# Altium project rp2040.PrjPcb
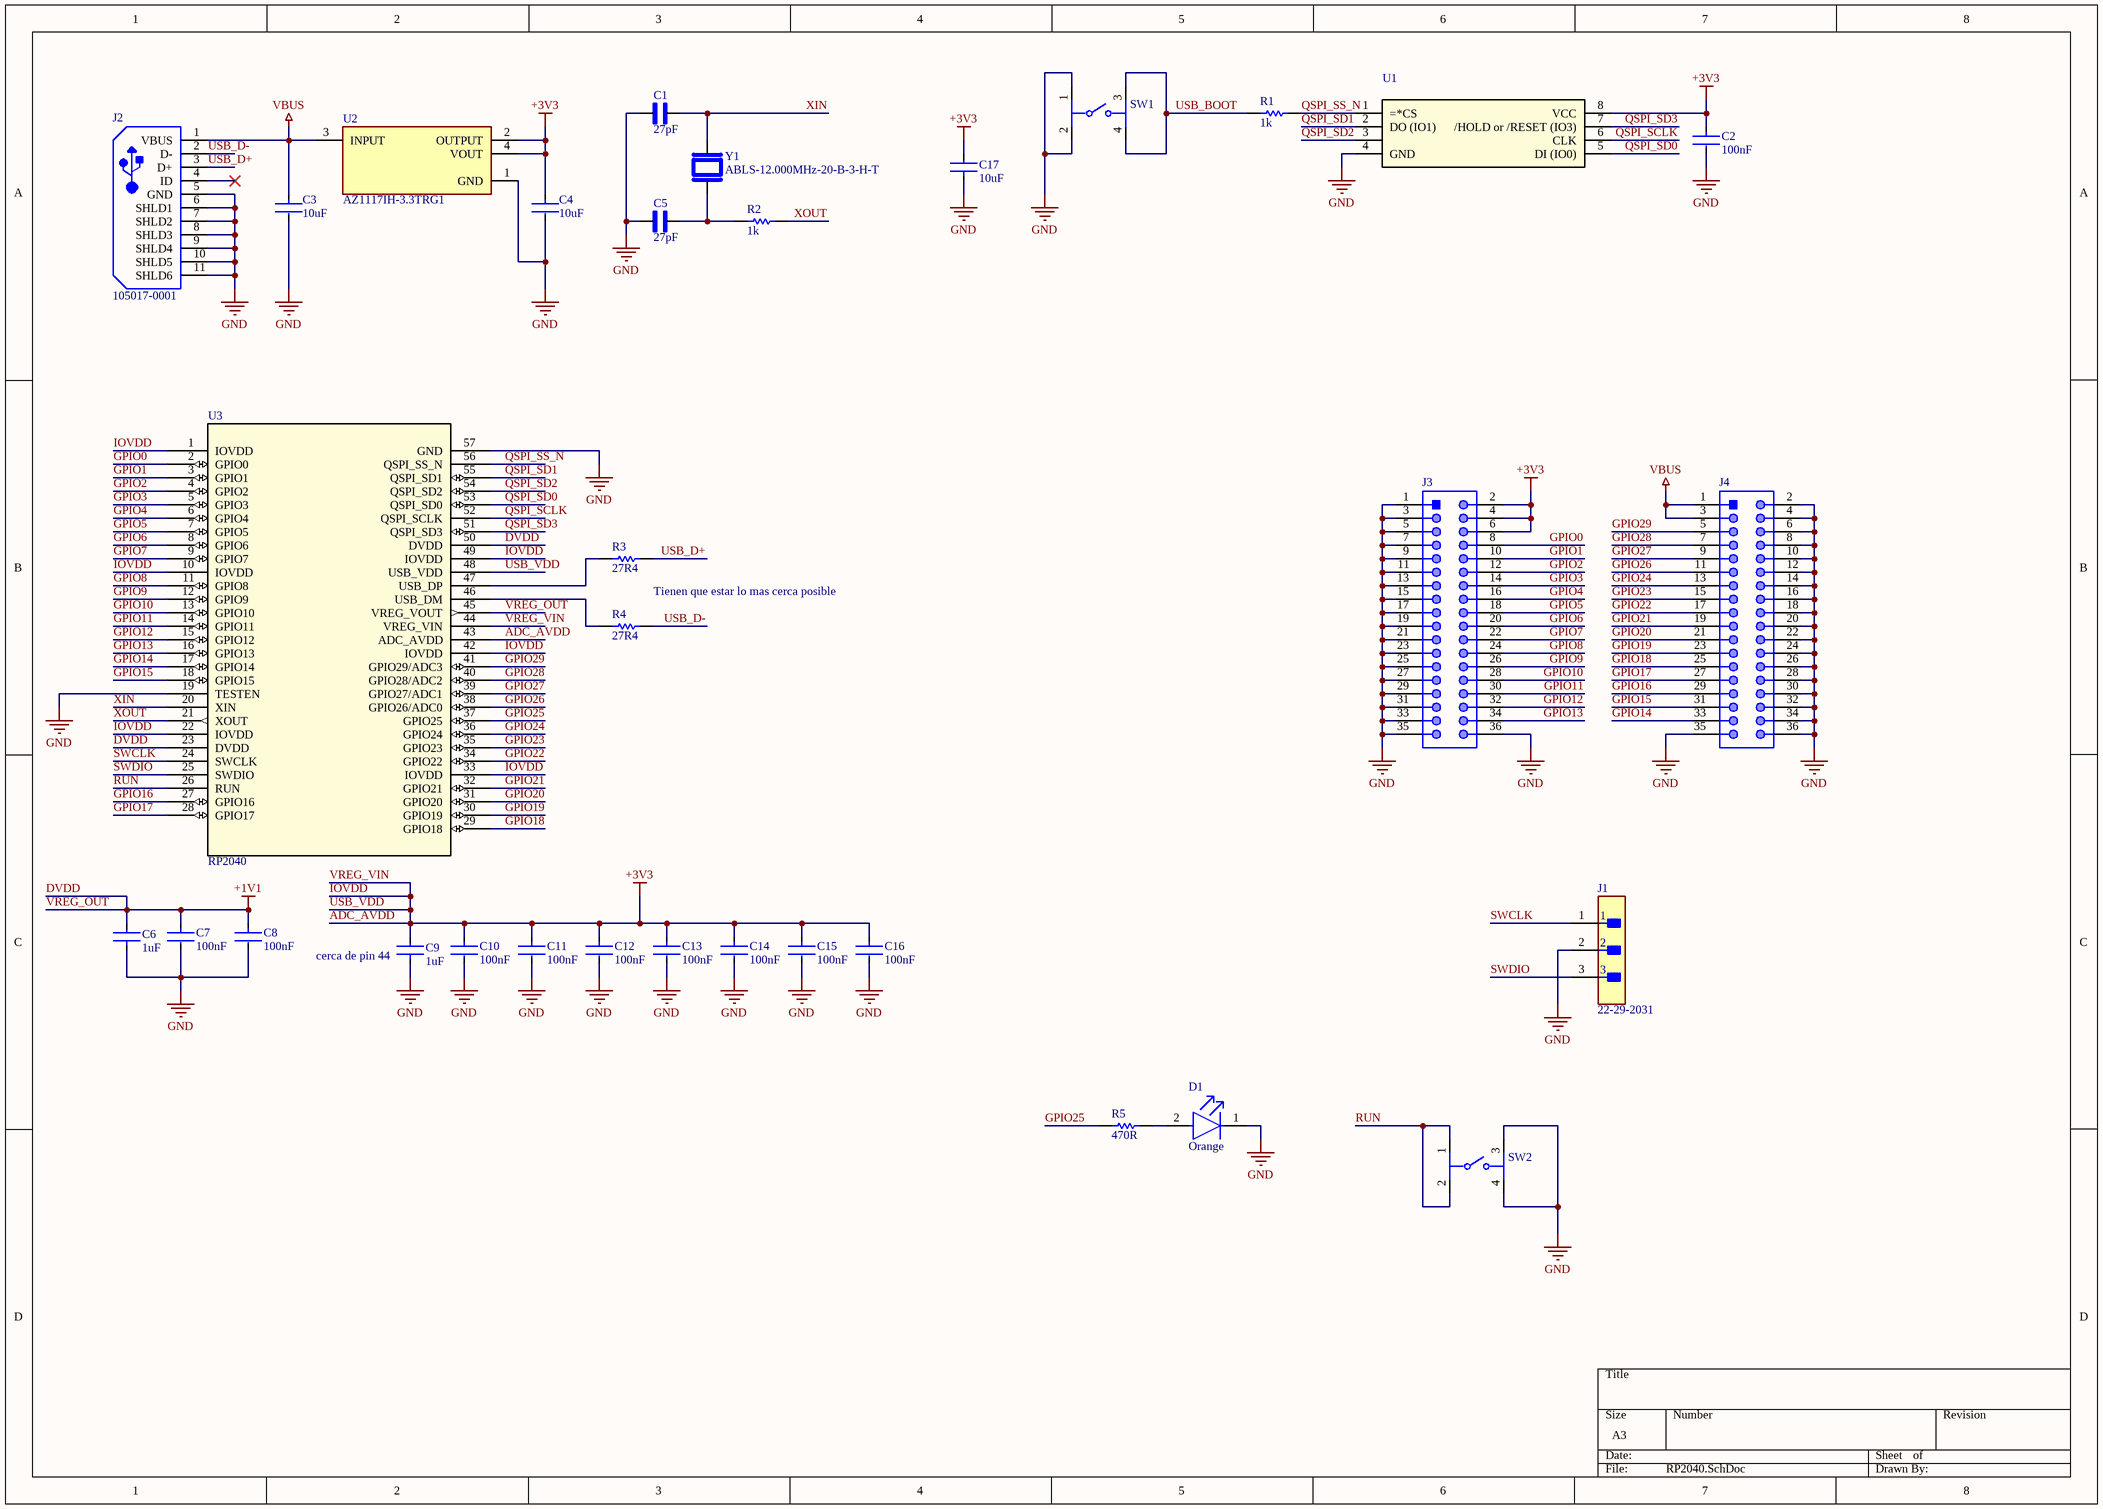
[diagram p0: RP2040.SchDoc]
1 sheet, 33 parts. Net scope: global (net labels, ports and power ports of the same name join across sheets).
Board file: RP2040.PcbDoc

## Sheet RP2040.SchDoc
size A3

### Parts
C1  Capacitance: 27pF  [CAPC2012X140N]  (hidden comment: CL21C270JCANNNC)
C2  Capacitance: 100nF  [FP-CL21-IPC_C]  (hidden comment: CL21B104KBCNNNC)
C3  Capacitance: 10uF  [FP-GRM21B-0_1-IPC_A]  (hidden comment: GRM21BR61C106KE15K)
C4  Capacitance: 10uF  [FP-GRM21B-0_1-IPC_A]  (hidden comment: GRM21BR61C106KE15K)
C5  Capacitance: 27pF  [CAPC2012X140N]  (hidden comment: CL21C270JCANNNC)
C6  Capacitance: 1uF  [FP-CL21-IPC_A]  (hidden comment: CL21B105KOFNNNE)
C7  Capacitance: 100nF  [FP-CL21-IPC_A]  (hidden comment: CL21B104KBCNNNC)
C8  Capacitance: 100nF  [FP-CL21-IPC_A]  (hidden comment: CL21B104KBCNNNC)
C9  Capacitance: 1uF  [FP-CL21-IPC_A]  (hidden comment: CL21B105KOFNNNE)
C10  Capacitance: 100nF  [FP-CL21-IPC_A]  (hidden comment: CL21B104KBCNNNC)
C11  Capacitance: 100nF  [FP-CL21-IPC_A]  (hidden comment: CL21B104KBCNNNC)
C12  Capacitance: 100nF  [FP-CL21-IPC_A]  (hidden comment: CL21B104KBCNNNC)
C13  Capacitance: 100nF  [FP-CL21-IPC_A]  (hidden comment: CL21B104KBCNNNC)
C14  Capacitance: 100nF  [FP-CL21-IPC_A]  (hidden comment: CL21B104KBCNNNC)
C15  Capacitance: 100nF  [FP-CL21-IPC_A]  (hidden comment: CL21B104KBCNNNC)
C16  Capacitance: 100nF  [FP-CL21-IPC_A]  (hidden comment: CL21B104KBCNNNC)
C17  Capacitance: 10uF  [FP-GRM21B-0_1-IPC_A]  (hidden comment: GRM21BR61C106KE15K)
D1  Illumination Color: Orange  [FP-APTR3216SECK-MFG]  (hidden comment: APTR3216SECK)
J1  22-29-2031  [FP-22-29-2031-MFG]
J2  105017-0001  [USB-MICRO-B_V]
J3  61303621121  [61303621121]  (value not drawn)
J4  61303621121  [61303621121]  (value not drawn)
R1  Resistance: 1k  [RESC2013X60X35ML10T20]  (hidden comment: RC0805JR-131KL)
R2  Resistance: 1k  [RESC2013X60X35ML10T20]  (hidden comment: RC0805JR-131KL)
R3  Resistance: 27R4  [RESC2013X60X30NL20T20]  (hidden comment: RK73H2ATTD27R4F)
R4  Resistance: 27R4  [RESC2013X60X30NL20T20]  (hidden comment: RK73H2ATTD27R4F)
R5  Resistance: 470R  [RESC2013X60X35LL10T20]  (hidden comment: RC0805FR-07470RL)
SW1  PTS526SK15SMTR2LFS  [FP-PTS526SK15SMTR2LFS-MFG]  (value not drawn)
SW2  PTS526SK15SMTR2LFS  [FP-PTS526SK15SMTR2LFS-MFG]  (value not drawn)
U1  W25Q128JVSIQ  [W25Q128JVSIQ]  (value not drawn)
U2  AZ1117IH-3.3TRG1  [FP-SOT223-IPC_B]
U3  RP2040  [RP2040]
Y1  ABLS-12.000MHz-20-B-3-H-T  [XTAL_ABLS-12.000MHz-20-B-3-H-T]

### Nets
ADC_AVDD: C2.1 C4.1 C9.2 C10.1 C11.1 C12.1 C13.1 C14.1 C15.1 C16.1 C17.2 J3.2 J3.4 J3.6 U1.8(VCC) U2.2(OUTPUT) U2.4(VOUT) U3.1(IOVDD) U3.10(IOVDD) U3.22(IOVDD) U3.33(IOVDD) U3.42(IOVDD) U3.43(ADC_AVDD) U3.44(VREG_VIN) U3.48(USB_VDD) U3.49(IOVDD)  [also labelled +3V3, IOVDD, USB_VDD, VREG_VIN]
DVDD: C6.2 C7.1 C8.1 U3.23(DVDD) U3.45(VREG_VOUT) U3.50(DVDD)  [also labelled +1V1, VREG_OUT]
GND: C1.2 C2.2 C3.2 C4.2 C5.2 C6.1 C7.2 C8.2 C9.1 C10.2 C11.2 C12.2 C13.2 C14.2 C15.2 C16.2 C17.1 D1.1(C) J1.2 J2.5(GND) J2.6(SHLD1) J2.7(SHLD2) J2.8(SHLD3) J2.9(SHLD4) J2.10(SHLD5) J2.11(SHLD6) J3.1 J3.3 J3.5 J3.7 J3.9 J3.11 J3.13 J3.15 J3.17 J3.19 J3.21 J3.23 J3.25 J3.27 J3.29 J3.31 J3.33 J3.35 J3.36 J4.2 J4.4 J4.6 J4.8 J4.10 J4.12 J4.14 J4.16 J4.18 J4.20 J4.22 J4.24 J4.26 J4.28 J4.30 J4.32 J4.34 J4.35 J4.36 SW1.1 SW1.2 SW2.3 SW2.4 U1.4(GND) U2.1(GND) U3.19(TESTEN) U3.57(GND)
VBUS: C3.1 J2.1(VBUS) J4.1 J4.3 U2.3(INPUT)
GPIO0: J3.8 U3.2(GPIO0)
GPIO1: J3.10 U3.3(GPIO1)
GPIO2: J3.12 U3.4(GPIO2)
GPIO3: J3.14 U3.5(GPIO3)
GPIO4: J3.16 U3.6(GPIO4)
GPIO5: J3.18 U3.7(GPIO5)
GPIO6: J3.20 U3.8(GPIO6)
GPIO7: J3.22 U3.9(GPIO7)
GPIO8: J3.24 U3.11(GPIO8)
GPIO9: J3.26 U3.12(GPIO9)
GPIO10: J3.28 U3.13(GPIO10)
GPIO11: J3.30 U3.14(GPIO11)
GPIO12: J3.32 U3.15(GPIO12)
GPIO13: J3.34 U3.16(GPIO13)
GPIO14: J4.33 U3.17(GPIO14)
GPIO15: J4.31 U3.18(GPIO15)
GPIO16: J4.29 U3.27(GPIO16)
GPIO17: J4.27 U3.28(GPIO17)
GPIO18: J4.25 U3.29(GPIO18)
GPIO19: J4.23 U3.30(GPIO19)
GPIO20: J4.21 U3.31(GPIO20)
GPIO21: J4.19 U3.32(GPIO21)
GPIO22: J4.17 U3.34(GPIO22)
GPIO23: J4.15 U3.35(GPIO23)
GPIO24: J4.13 U3.36(GPIO24)
GPIO25: R5.1 U3.37(GPIO25)
GPIO26: J4.11 U3.38(GPIO26/ADC0)
GPIO27: J4.9 U3.39(GPIO27/ADC1)
GPIO28: J4.7 U3.40(GPIO28/ADC2)
GPIO29: J4.5 U3.41(GPIO29/ADC3)
QSPI_SCLK: U1.6(CLK) U3.52(QSPI_SCLK)
QSPI_SD0: U1.5(DI_(IO0)) U3.53(QSPI_SD0)
QSPI_SD1: U1.2(DO_(IO1)) U3.55(QSPI_SD1)
QSPI_SD2: U1.3(/WP_(IO2)) U3.54(QSPI_SD2)
QSPI_SD3: U1.7(/HOLD_or_/RESET_(IO3)) U3.51(QSPI_SD3)
QSPI_SS_N: R1.1 U1.1(=*CS) U3.56(QSPI_SS_N)
RUN: SW2.1 SW2.2 U3.26(RUN)
SWCLK: J1.1 U3.24(SWCLK)
SWDIO: J1.3 U3.25(SWDIO)
USB_BOOT: R1.2 SW1.3 SW1.4
USB_D+: J2.3(D+) R3.1
USB_D-: J2.2(D-) R4.1
XIN: C1.1 U3.20(XIN) Y1.2
XOUT: R2.1 U3.21(XOUT)
NetC5_1: C5.1 R2.2 Y1.1
NetD1_2: D1.2(A) R5.2
NetR3_2: R3.2 U3.47(USB_DP)
NetR4_2: R4.2 U3.46(USB_DM)

Not connected (* = marked no-connect by the designer): J2 4(ID)*

### Notes on the sheet
- Tienen que estar lo mas cerca posible
- (near C9) cerca de pin 44

### Library data of the parts
C1 C5 = CL21C270JCANNNC: CL21 Series 27 pF 100 V ±5 % Tolerance C0G SMT Multilayer Ceramic Capacitor; Manufacturer: Samsung; Tolerance: 5%; Voltage Rating: 100V; Temperature Coefficient: 300ppm/°C; Package: None; Price: None; Value: *; MP: CL21C270JCANNNC; Availability: Unavailable; Supplier 1: Digi-Key; Manufacturer Part Number: CL21C270JCANNNC; RoHS: Yes; Category: Ceramic Capacitors; Stock 1: 133925; Pricing 1: 1=0.10000, 10=0.05700, 50=0.03100, 100=0.02520, 500=0.01802, 1000=0.01417 (USD); Mount: Surface Mount; Case/Package: 0805; Case Code (Metric): 2012; Case Code (Imperial): 0805; Min Operating Temperature: -55°C; Max Operating Temperature: 125°C; Dielectric: C0G; Packaging: Tape and Reel; Package Quantity: 1; Voltage: 100V; Voltage Rating (DC): 100V; Series: CL; Construction: Flat; Length: 2mm; Width: 0.049inch; Height: 0.65mm; Depth: 1.25mm; Thickness: 0.03inch; Radiation Hardening: No; Lead Free: Lead Free; RoHS Compliant: Yes; ComponentLink1URL: https://datasheet.ciiva.com/25740/cl21c270jcannnc-25740793.pdf?src-supplier=Digi-Key; ComponentLink1Description: https://datasheet.ciiva.com/25740/cl21c270jcannnc-25740793.pdf?src-supplier=Digi-Key; Supplier Part Number 1: 1276-2622-1-ND
C2 C7 C8 C10-C16 = CMP-2000-05017-2: CL21 Series 0805 100nF 50V ±10% Tolerance X7R Multilayer Ceramic Chip Capacitor; Manufacturer: Samsung; Depth: 1.25mm; Height: 0.85mm; Width: 0.049inch; Tolerance: 10%; Case Code (Metric): 2012; Case Code (Imperial): 0805; Material: Ceramic; Thickness: 0.037inch; Min Operating Temperature: -55°C; Contact Plating: Tin; Length: 2mm; Mount: Surface Mount; Voltage Rating (DC): 50V; Lead Free: Lead Free; Dielectric: X7R; Radiation Hardening: No; Voltage Rating: 50V; Case/Package: 0805; Packaging: Tape and Reel; Max Operating Temperature: 125°C; Voltage: 50V; Supplier 1: Digi-Key; Supplier Part Number 1: 1276-1003-1-ND; Manufacturer Part Number: CL21B104KBCNNNC; RoHS: Yes; Category: Ceramic Capacitors; Stock 1: 3609597; Pricing 1: 1=0.10000, 10=0.04400, 50=0.02400, 100=0.01960, 500=0.01404, 1000=0.01103 (USD); Series: CL; Construction: Flat; RoHS Compliant: Yes; ComponentLink1URL: https://datasheet.ciiva.com/25710/cl21b104kbcnnnc-25710182.pdf?src-supplier=Digi-Key; ComponentLink1Description: https://datasheet.ciiva.com/25710/cl21b104kbcnnnc-25710182.pdf?src-supplier=Digi-Key; ComponentLink2URL: https://datasheet.ciiva.com/29199/454152-da-01-en-vs-kondensator-0805-29199814.pdf?src-supplier=Conrad; ComponentLink2Description: https://datasheet.ciiva.com/29199/454152-da-01-en-vs-kondensator-0805-29199814.pdf?src-supplier=Conrad
C3 C4 C17 = CMP-2007-03534-2: Chip Multilayer Ceramic Capacitors for General Purpose, 0805, 10uF, X5R, 15%, 10%, 16V; Manufacturer: Murata; Case Code (Imperial): 0805; Packaging: Tape and Reel; Width: 0.049inch; Depth: 1.25mm; Voltage Rating: 16V; Height: 1.25mm; Case/Package: 0805; Max Operating Temperature: 85°C; Min Operating Temperature: -55°C; Tolerance: 10%; Dielectric: X5R; REACH SVHC: No SVHC; Mount: Surface Mount; Radiation Hardening: No; Case Code (Metric): 2012; Length: 2mm; Package Quantity: 10000; Voltage Rating (DC): 16V; Voltage: 16V; Thickness: 0.053inch; Termination: SMD/SMT; Supplier 1: Digi-Key; Supplier Part Number 1: 490-6473-1-ND; Manufacturer Part Number: GRM21BR61C106KE15K; RoHS: Yes; Category: Ceramic Capacitors; Pricing 1: 1=0.18000, 10=0.13100, 50=0.07420, 100=0.06150, 500=0.04312, 1000=0.03570, 2500=0.03323, 5000=0.03040 (USD); Series: GRM; Construction: Flat; Reach SVHC Compliant: Yes; RoHS Compliant: Yes; ComponentLink1URL: https://datasheet.ciiva.com/26822/getdatasheetpartid-31687-26822939.pdf?src-supplier=Verical; ComponentLink1Description: https://datasheet.ciiva.com/26822/getdatasheetpartid-31687-26822939.pdf?src-supplier=Verical; ComponentLink2URL: https://datasheet.ciiva.com/6270/partnumbering-e-01-6270410.pdf?src-supplier=Digi-Key; ComponentLink2Description: https://datasheet.ciiva.com/6270/partnumbering-e-01-6270410.pdf?src-supplier=Digi-Key; ComponentLink3URL: https://datasheet.ciiva.com/6270/partnumbering-e-01-6270407.pdf?src-supplier=Digi-Key; ComponentLink3Description: https://datasheet.ciiva.com/6270/partnumbering-e-01-6270407.pdf?src-supplier=Digi-Key; ComponentLink4URL: https://datasheet.ciiva.com/6270/partnumbering-e-01-6270412.pdf?src-supplier=Digi-Key; ComponentLink4Description: https://datasheet.ciiva.com/6270/partnumbering-e-01-6270412.pdf?src-supplier=Digi-Key; ComponentLink5URL: https://datasheet.ciiva.com/5414/product-5414934.pdf?src-supplier=Mouser; ComponentLink5Description: https://datasheet.ciiva.com/5414/product-5414934.pdf?src-supplier=Mouser
  C3 C4: Stock 1: 2364831
  C17: Stock 1: 2364631
C6 C9 = CMP-13271-003098-1: CL21 Series 0805 1uF 16V ±10% Tolerance X7R Multilayer Ceramic Chip Capacitor; Manufacturer: Samsung; Case Code (Metric): 2012; Width: 0.049inch; Thickness: 0.053inch; Voltage Rating: 16V; Max Operating Temperature: 125°C; Case Code (Imperial): 0805; Height: 1.25mm; Length: 2mm; Case/Package: 0805; Lead Free: Lead Free; Mount: Surface Mount; Tolerance: 10%; Voltage Rating (DC): 16V; Min Operating Temperature: -55°C; Contact Plating: Tin; Depth: 1.25mm; Packaging: Tape and Reel; Package Quantity: 1; Voltage: 16V; Dielectric: X7R; Radiation Hardening: No; Supplier 1: Digi-Key; Supplier Part Number 1: 1276-1026-1-ND; Manufacturer Part Number: CL21B105KOFNNNE; RoHS: Yes; Category: Ceramic Capacitors; Stock 1: 664825; Pricing 1: 1=0.10000, 10=0.05100, 50=0.02800, 100=0.02290, 500=0.01636, 1000=0.01286 (USD); Series: CL; Construction: Flat; RoHS Compliant: Yes; ComponentLink1URL: https://datasheet.ciiva.com/25800/cl21b105kofnnne-25800257.pdf?src-supplier=Digi-Key; ComponentLink1Description: https://datasheet.ciiva.com/25800/cl21b105kofnnne-25800257.pdf?src-supplier=Digi-Key; ComponentLink2URL: https://datasheet.ciiva.com/26838/getdatasheetpartid-358361-26838673.pdf?src-supplier=Verical; ComponentLink2Description: https://datasheet.ciiva.com/26838/getdatasheetpartid-358361-26838673.pdf?src-supplier=Verical; ComponentLink3URL: https://datasheet.ciiva.com/26310/mlcc-catalogdownload2013-eng-26310166.pdf?src-supplier=Distrelec; ComponentLink3Description: https://datasheet.ciiva.com/26310/mlcc-catalogdownload2013-eng-26310166.pdf?src-supplier=Distrelec
D1 = CMP-44529-000069-1: LED ORANGE CLEAR CHIP SMD; Manufacturer: Kingbright; Number of LEDs: 1; Dominant Wavelength: 601nm; Forward Voltage: 2.1V; Test Current: 20mA; Power Rating: 75mW; Viewing Angle: 120°; Luminous Intensity: 240mcd; Color: Orange; Min Operating Temperature: -40°C; Series: APTR; Height: 1.05mm; Max Operating Temperature: 85°C; Case Code (Metric): 3216; Lens Style: Clear; Packaging: Tape and Reel; Lead Free: Lead Free; Lens Color: Clear; Number of Pins: 2; RoHS Compliant: Yes; Width: 1.6mm; Case Code (Imperial): 1206; Forward Current: 20mA; Mount: Surface Mount; Length: 3.2mm; Package Quantity: 2000; Case/Package: 1206; Wavelength: 601nm; Supplier 1: Digi-Key; Supplier Part Number 1: 754-1170-2-ND; Manufacturer Part Number: APTR3216SECK; RoHS: Yes; Category: LEDs; Stock 1: 4000; Pricing 1: 2000=0.07000, 6000=0.06300, 10000=0.05600, 50000=0.04725, 100000=0.04550 (USD); ComponentLink1URL: https://datasheet.ciiva.com/2120/aptr3216seck-2120882.pdf?src-supplier=Digi-Key; ComponentLink1Description: https://datasheet.ciiva.com/2120/aptr3216seck-2120882.pdf?src-supplier=Digi-Key; ComponentLink2URL: https://datasheet.ciiva.com/12400/aptr3216seck-39406-12400858.pdf?src-supplier=Mouser; ComponentLink2Description: https://datasheet.ciiva.com/12400/aptr3216seck-39406-12400858.pdf?src-supplier=Mouser; ComponentLink3URL: https://datasheet.ciiva.com/2120/aptr3216seck-2120883.pdf?src-supplier=Digi-Key; ComponentLink3Description: https://datasheet.ciiva.com/2120/aptr3216seck-2120883.pdf?src-supplier=Digi-Key; ComponentLink4URL: https://datasheet.ciiva.com/2120/aptr3216seck-2120884.pdf?src-supplier=Digi-Key; ComponentLink4Description: https://datasheet.ciiva.com/2120/aptr3216seck-2120884.pdf?src-supplier=Digi-Key; ComponentLink5URL: https://datasheet.ciiva.com/14604/70062889-14604443.pdf?src-supplier=Allied+Electronics; ComponentLink5Description: https://datasheet.ciiva.com/14604/70062889-14604443.pdf?src-supplier=Allied+Electronics
J1 = CMP-04776-000327-1: CONN HEADER VERT 3POS 2.54MM; Contact Resistance: 10mR; Number of Positions: 3; Voltage Rating: 250V; Gender: Male; Connector Type: Male Pin; Current Rating: 4A; Packaging: Bulk; Housing Material: Nylon; Min Operating Temperature: 0°C; Color: Natural; RoHS Compliant: Yes; Housing Color: White; Number of Rows: 1; Pitch: 2.54mm; Mount: Through Hole; Fastening Type: Friction; Length: 7.62mm; Depth: 5.8mm; Contact Material: Brass; Max Operating Temperature: 75°C; Number of Contacts: 3; Contact Type: Male Pin; Working Voltage: 250V; Orientation: Straight; Lead Pitch: 2.54mm; Radiation Hardening: No; Termination: Solder; Contact Plating: Gold; Contact Mating Length: 0.295inch; Series: KK® 6410
J2 = CMP-2000-05827-1: Micro-USB B Receptacle, Right Angle, Bottom Mount, Surface Mount, with Solder Tabs, -30 to 85 degC, 5-Pin USB, RoHS, Tape and Reel; Manufacturer: Molex; Featured Product: Micro-USBConnectorsUSBConnectors; Other Names: WM1399DKR; Package Version: Rev. F, 12/2012; Number of Contacts: 5; Connector Type: USB-microB; Catalog Drawings: 1050170001; 3D Model: 105017-0001.stp; Mating Products: WM17145-ND-CABLEMICROUSBBTOSTDA1.0MWM17147-ND-CABLEMICROUSBBTOSTDA2.0MWM17146-ND-CABLEMICROUSBBTOSTDA1.5M; PCN Assembly/Origin: ResinSupplier21/Oct/2015; Voltage - Max: 30V; Online Catalog: Molex-MicroUSB; Number of Ports: 1; USB Standard: USB 2.0; Mating Cycles: 10000; Shielding: Shielded; Current Rating: 1.8A; Pitch: 0.65mm; Manufacturer URL: http://www.molex.com/; Package Description: 5-Leads USB, Micro B, Body 7.5 x 5 mm, Pitch 0.65 mm; Datasheet URL: http://www.molex.com/elqNow/elqRedir.htm?ref=http://www.molex.com/webdocs/datasheets/pdf/en-us/1050170001_IO_CONNECTORS.pdf; Ingress Protection: -; Datasheet Version: 03/2016; Mounting Type: BoardCutout,SurfaceMount,RightAngle; Circuits: 5; Standard Package: 1; Package Reference: MICRO-B; Package URL: http://www.molex.com/pdm_docs/sd/1050170001_sd.pdf; Category: Connectors,Interconnects; Series: -; RoHS Information: 1050170001CertofCompliance; Features: Shielded,SolderRetention; Family: USB,DVI,HDMIConnectors; Specifications: -; Gender: Receptacle; Packaging: Digi-Reel®; Mounting Technology: SurfaceMount; Supplier 1: Digi-Key; Supplier Part Number 1: WM1399CT-ND; Manufacturer Part Number: 1050170001; RoHS: Yes; Stock 1: 51039; Pricing 1: 1=1.01000, 10=0.84000, 100=0.69990, 1000=0.55994 (USD); Mount: Surface Mount; Contact Plating: Gold; Contact Material: Copper Alloy,Copper; Insulation Color: Black; Number of Terminals/Pins: 5; Housing Material: Polymer; Min Operating Temperature: -30°C; Max Operating Temperature: 85°C; Termination: Solder; Orientation: Right Angle; Package Quantity: 2000; Voltage Rating (AC): 30V; Max Voltage Rating (AC): 30V; Voltage Rating: 30V; Number of Positions: 5; Number of Circuits: 5; Length: 8.2mm; Depth: 7.5mm; Radiation Hardening: No; Flammability Rating: UL94 V-0; RoHS Compliant: Yes; Halogen Free: Low Halogen
J3 J4 = CMP-1502-01131-1: THT Vertical Pin Header WR-PHD, Pitch 2.54 mm, Dual Row, 36 pins; Manufacturer: Wurth Elektronik; Gender: Male; Working Voltage: 250VAC; Pin Number: 36; Pitch: 2.54mm; Contact Resistance: 20mOhm; Rated Current: 3A; Withstanding Voltage: 500VAC; Voltage Rating: 250V; Row Spacing: 0.1inch; Row Number: Dual; Package Reference: 61303621121; Publisher: WurthElektronik; Datasheet URL: https://katalog.we-online.de/em/datasheet/6130xx21121.pdf; Part Number: 61303621121; Mounting Technology: THT; Manufacturer URL: http://www.we-online.de; Packaging: Bag; Orientation: Vertical; Operating Temperature: -40to105degC; Supplier 1: Digi-Key; Supplier Part Number 1: 732-5309-ND; Manufacturer Part Number: 61303621121; RoHS: Yes; Category: Connectors; Stock 1: 1395; Pricing 1: 1=1.84000, 10=1.55900, 25=1.30000, 50=1.08400, 100=0.98500, 500=0.89500 (USD); Mount: Through Hole; Contact Plating: Gold; Contact Material: Copper Alloy,Copper; Color: Black; Contact Shape: Square; Contact Finish - Mating: GOLD; Insulation Material: Nylon; Insulation Color: Black; Min Operating Temperature: -40°C; Max Operating Temperature: 105°C; Number of Rows: 2; Termination: Solder; Number of Contacts: 36; Number of Positions: 36; Connector Type: Header; Series: WR-PHD; Contact Type: Male Pin; Fastening Type: Pull; Contact Mating Length: 0.236inch; RoHS Compliant: Yes; Flammability Rating: UL94 V-0; ComponentLink1URL: http://www.farnell.com/datasheets/1442180.pdf?src-supplier=Farnell; ComponentLink1Description: http://www.farnell.com/datasheets/1442180.pdf?src-supplier=Farnell; ComponentLink2URL: http://www.farnell.com/datasheets/1442180.pdf?src-supplier=Newark; ComponentLink2Description: http://www.farnell.com/datasheets/1442180.pdf?src-supplier=Newark; ComponentLink3URL: http://www.farnell.com/datasheets/1442180.pdf?src-supplier=Element14; ComponentLink3Description: http://www.farnell.com/datasheets/1442180.pdf?src-supplier=Element14; ComponentLink4URL: https://katalog.we-online.de/em/datasheet/6130xx21121.pdf?src-supplier=Digi-Key; ComponentLink4Description: https://katalog.we-online.de/em/datasheet/6130xx21121.pdf?src-supplier=Digi-Key
R1 = CMP-2001-01418-1: Manufacturer: Yageo; Tolerance: 5%; Temperature Coefficient: 100ppm/°C; Power Rating: 125mW; Voltage Rating: 150V; Description: Res Thick Film 0805 1K Ohm 5% 0.125W(1/8W) ±100ppm/C Pad SMD T/R; Value: 1kR; Part Number: RC0805JR-131KL; Supplier 1: Digi-Key; Supplier Part Number 1: 13-RC0805JR-131KLCT-ND; Manufacturer Part Number: RC0805JR-131KL; RoHS: Yes; Category: Chip SMD Resistors; Stock 1: 180007; Pricing 1: 1=0.10000, 10=0.02800, 100=0.01150, 1000=0.00517, 2500=0.00448, 5000=0.00370 (USD); Case/Package: 0805; Number of Pins: 2; Contact Plating: Tin,Lead; Case Code (Imperial): 0805; Case Code (Metric): 2012; Size Code: 0805; Min Operating Temperature: -55°C; Max Operating Temperature: 155°C; Resistor Type: Thick Film; Packaging: Tape and Reel; Termination: SMD/SMT; Voltage Rating (DC): 150V; Series: RC; Construction: Rectangular; Resistance Tolerance: 5%; Length: 2mm; Width: 1.25mm; Height: 0.5mm; Depth: 1.25mm; Radiation Hardening: No; RoHS Compliant: Yes; Reach SVHC Compliant: Yes; Military Standard: Not; Lead Free: Lead Free; ComponentLink1URL: https://datasheet.ciiva.com/12560/rc0805-257173-12560870.pdf?src-supplier=Mouser; ComponentLink1Description: https://datasheet.ciiva.com/12560/rc0805-257173-12560870.pdf?src-supplier=Mouser; ComponentLink2URL: https://datasheet.ciiva.com/17333/rc0805-17333917.pdf?src-supplier=Future+Electronics; ComponentLink2Description: https://datasheet.ciiva.com/17333/rc0805-17333917.pdf?src-supplier=Future+Electronics; ComponentLink3URL: https://datasheet.ciiva.com/7983/444164-7983797.pdf?src-supplier=Element14; ComponentLink3Description: https://datasheet.ciiva.com/7983/444164-7983797.pdf?src-supplier=Element14; Pins: 2
R2 = CMP-2001-01418-1: Manufacturer: Yageo; Tolerance: 5%; Temperature Coefficient: 100ppm/°C; Power Rating: 125mW; Voltage Rating: 150V; Part Number: RC0805JR-131KL; Supplier 1: Digi-Key; Supplier Part Number 1: 13-RC0805JR-131KLCT-ND; Manufacturer Part Number: RC0805JR-131KL; RoHS: Yes; Category: Chip SMD Resistors; Stock 1: 181610; Pricing 1: 1=0.10000, 10=0.02800, 100=0.01150, 1000=0.00517, 2500=0.00448, 5000=0.00370 (USD); Case/Package: 0805; Number of Pins: 2; Contact Plating: Tin,Lead; Case Code (Imperial): 0805; Case Code (Metric): 2012; Size Code: 0805; Min Operating Temperature: -55°C; Max Operating Temperature: 155°C; Resistor Type: Thick Film; Packaging: Tape and Reel; Termination: SMD/SMT; Voltage Rating (DC): 150V; Series: RC; Construction: Rectangular; Resistance Tolerance: 5%; Length: 2mm; Width: 1.25mm; Height: 0.5mm; Depth: 1.25mm; Radiation Hardening: No; RoHS Compliant: Yes; Reach SVHC Compliant: Yes; Military Standard: Not; Lead Free: Lead Free; ComponentLink1URL: https://datasheet.ciiva.com/12560/rc0805-257173-12560870.pdf?src-supplier=Mouser; ComponentLink1Description: https://datasheet.ciiva.com/12560/rc0805-257173-12560870.pdf?src-supplier=Mouser; ComponentLink2URL: https://datasheet.ciiva.com/17333/rc0805-17333917.pdf?src-supplier=Future+Electronics; ComponentLink2Description: https://datasheet.ciiva.com/17333/rc0805-17333917.pdf?src-supplier=Future+Electronics; ComponentLink3URL: https://datasheet.ciiva.com/7983/444164-7983797.pdf?src-supplier=Element14; ComponentLink3Description: https://datasheet.ciiva.com/7983/444164-7983797.pdf?src-supplier=Element14
R3 = CMP-2001-02274-1: Res Thick Film 0805 27.4 Ohm 1% 0.25W(1/4W) ±100ppm/C Pad SMD Automotive T/R; Manufacturer: KOA Speer; Voltage Rating: 150V; Power Rating: 125mW; Temperature Coefficient: 100ppm/°C; Value: 27.4R; Part Number: RK73H2ATTD27R4F; Supplier 1: Digi-Key; Supplier Part Number 1: 2019-RK73H2ATTD27R4FCT-ND; Manufacturer Part Number: RK73H2ATTD27R4F; RoHS: Yes; Category: Chip SMD Resistors; Stock 1: 40520; Pricing 1: 1=0.10000, 10=0.03900, 100=0.01610, 1000=0.00721, 2500=0.00626 (USD); Case/Package: 0805; Case Code (Imperial): 0805; Case Code (Metric): 2012; Min Operating Temperature: -55°C; Max Operating Temperature: 155°C; Packaging: Tape and Reel; Package Quantity: 5000; Tolerance: 1%; Resistor Type: Thick Film; Termination: SMD/SMT; Voltage Rating (DC): 150V; Series: RK73H; Construction: Rectangular; Length: 2mm; Width: 1.25mm; Height: 0.5mm; Depth: 1.25mm; Military Standard: Not; RoHS Compliant: Yes; ComponentLink1URL: https://datasheet.ciiva.com/5554/rk73h-5554015.pdf?src-supplier=Mouser; ComponentLink1Description: https://datasheet.ciiva.com/5554/rk73h-5554015.pdf?src-supplier=Mouser
R4 = CMP-2001-02274-1: Res Thick Film 0805 27.4 Ohm 1% 0.25W(1/4W) ±100ppm/C Pad SMD Automotive T/R; Manufacturer: KOA Speer; Voltage Rating: 150V; Power Rating: 125mW; Temperature Coefficient: 100ppm/°C; Value: 27R4; Part Number: RK73H2ATTD27R4F; Supplier 1: Digi-Key; Supplier Part Number 1: 2019-RK73H2ATTD27R4FCT-ND; Manufacturer Part Number: RK73H2ATTD27R4F; RoHS: Yes; Category: Chip SMD Resistors; Stock 1: 40520; Pricing 1: 1=0.10000, 10=0.03900, 100=0.01610, 1000=0.00721, 2500=0.00626 (USD); Case/Package: 0805; Case Code (Imperial): 0805; Case Code (Metric): 2012; Min Operating Temperature: -55°C; Max Operating Temperature: 155°C; Packaging: Tape and Reel; Package Quantity: 5000; Tolerance: 1%; Resistor Type: Thick Film; Termination: SMD/SMT; Voltage Rating (DC): 150V; Series: RK73H; Construction: Rectangular; Length: 2mm; Width: 1.25mm; Height: 0.5mm; Depth: 1.25mm; Military Standard: Not; RoHS Compliant: Yes; ComponentLink1URL: https://datasheet.ciiva.com/5554/rk73h-5554015.pdf?src-supplier=Mouser; ComponentLink1Description: https://datasheet.ciiva.com/5554/rk73h-5554015.pdf?src-supplier=Mouser
R5 = CMP-2000-06961-1: Chip Resistor, 470 Ohm, +/- 1%, 125 mW, -55 to 155 degC, 0805 (2012 Metric), RoHS, Tape and Reel; Manufacturer: Yageo; Power Rating: 250mW; Resistor Case Style: 0805[2012Metric]; Voltage Rating: 150V; Resistor Element Type: ThickFilm; Temperature Coefficient: ±100ppm/°C; SVHC: ToBeAdvised; Max Power Dissipation: 125mW; Datasheet Version: Rev. 7, 05/2017; Automotive Qualification Standard: -; Mounting Technology: SurfaceMount; Product Range: -; Packaging: Tape&Reel; Package Description: 2-Pin Surface Mounted Device, Body 2 x 1.25 mm; MSL: MSL1-Unlimited; Package Reference: 0805; Resistance Tolerance: ±1%; Datasheet URL: http://www.yageo.com/documents/recent/PYu-RC_Group_51_RoHS_L_7.pdf; Manufacturer URL: http://www.yageo.com/; Supplier 1: Digi-Key; Supplier Part Number 1: 311-470CRCT-ND; Manufacturer Part Number: RC0805FR-07470RL; RoHS: Yes; Category: Chip SMD Resistors; Stock 1: 1517047; Pricing 1: 1=0.10000, 10=0.03300, 100=0.01330, 1000=0.00600, 2500=0.00520 (USD); Case/Package: 0805; Number of Pins: 2; Case Code (Metric): 2012; Case Code (Imperial): 0805; Size Code: 0805; Min Operating Temperature: -55°C; Max Operating Temperature: 155°C; Resistor Type: Thick Film; Tolerance: 1%; Voltage Rating (DC): 150V; Package Quantity: 5000; Termination: SMD/SMT; Series: RC; Number of Terminations: 2; Features: Moisture Resistant; Construction: Rectangular; Length: 2mm; Width: 1.25mm; Height: 0.5mm; Depth: 1.25mm; Lead Pitch: 0.4mm; Lead Free: Lead Free; RoHS Compliant: Yes; Military Standard: Not; ComponentLink1URL: https://datasheet.ciiva.com/46447/444164-46447580.pdf?src-supplier=Element14; ComponentLink1Description: https://datasheet.ciiva.com/46447/444164-46447580.pdf?src-supplier=Element14; ComponentLink2URL: https://datasheet.ciiva.com/2457/pyu-r-int-thick-7-2457057.pdf?src-supplier=Digi-Key; ComponentLink2Description: https://datasheet.ciiva.com/2457/pyu-r-int-thick-7-2457057.pdf?src-supplier=Digi-Key; ComponentLink3URL: https://datasheet.ciiva.com/2457/pyu-r-int-thick-7-2457058.pdf?src-supplier=Digi-Key; ComponentLink3Description: https://datasheet.ciiva.com/2457/pyu-r-int-thick-7-2457058.pdf?src-supplier=Digi-Key; ComponentLink4URL: https://datasheet.ciiva.com/2457/pyu-r-int-thick-7-2457056.pdf?src-supplier=Digi-Key; ComponentLink4Description: https://datasheet.ciiva.com/2457/pyu-r-int-thick-7-2457056.pdf?src-supplier=Digi-Key; ComponentLink5URL: https://datasheet.ciiva.com/7941/444164-7941798.pdf?src-supplier=Element14; ComponentLink5Description: https://datasheet.ciiva.com/7941/444164-7941798.pdf?src-supplier=Element14; ComponentLink6URL: https://datasheet.ciiva.com/7941/444164-7941797.pdf?src-supplier=Element14; ComponentLink6Description: https://datasheet.ciiva.com/7941/444164-7941797.pdf?src-supplier=Element14; ComponentLink7URL: https://datasheet.ciiva.com/16745/rc0805-16745229.pdf?src-supplier=Future+Electronics; ComponentLink7Description: https://datasheet.ciiva.com/16745/rc0805-16745229.pdf?src-supplier=Future+Electronics
SW1 SW2 = CMP-10040-000013-1: TACT 5.2 X 5.2, 1.5 MM H, 260GF,; Manufacturer: C&K; Operating Force: 250gf; Throw Configuration: SPST-NO; Contact Current Rating: 50mA; Standoff Height: 0mm; Contact Resistance: 100mΩ; Voltage Rating Dc: 12V; Electromechanical Life: 200000Cycles; Device Class L3: Tactile Switches; Device Class L2: Switches; Temperature: -20°C to +70°C; Temperature Range Low: -20°C; Package: PTS526SK15SMTR2LFS; Temperature Range High: +70°C; ComponentLink2Description: Datasheet; Device Class L1: Electromechanical; Height: 1.65mm; Digikey Description: TACT 5.2 X 5.2, 1.5 MM H, 260GF,; Category: Switch; RoHS: TRUE; Automotive: No; Lead Free: Yes; Manufacturer Part Number: PTS526SK15SMTR2LFS; Octopart: https://octopart.com/pts526+sk15+smtr2+lfs-c%26k+components-100617999; ComponentLink2URL: https://www.ckswitches.com/media/2780/pts526.pdf; Supplier 1: Digi-Key; Supplier Part Number 1: CKN12221-1-ND; Stock 1: 566829; Pricing 1: 1=0.12000, 10=0.12000, 25=0.11400, 100=0.10350, 250=0.09732, 500=0.08904, 1000=0.07454 (USD)
U1 = W25Q128JVSIQ: NOR Flash Serial (SPI, Dual SPI, Quad SPI) 3.3V 128M-bit 16M x 8 6ns 8-Pin SOIC Tube; Mfr_Name: Winbond; Memory Format: FLASH,NOR; Frequency: 104MHz; Interface: SPI,Serial; Copyright: Copyright (C) 2022 Ultra Librarian. All rights reserved.; Manufacturer_Part_Number: W25Q128JVSIQ; RefDes: RefDes; Type: DEV; Supplier 1: Digi-Key; Supplier Part Number 1: W25Q128JVSIQ-ND; Manufacturer: Winbond; Manufacturer Part Number: W25Q128JVSIQ; RoHS: Yes; Category: Flash; Stock 1: 162424; Pricing 1: 1=1.76000, 10=1.60800, 25=1.56440, 50=1.55640, 100=1.39130, 250=1.38724, 500=1.36630, 1000=1.30829, 5000=1.21807 (USD); Case/Package: SOIC; Min Operating Temperature: -40°C; Max Operating Temperature: 85°C; Packaging: Tray; RoHS Compliant: Yes; ComponentLink1URL: http://www.winbond.com/resource-files/w25q128jv%20revf%2003272018%20plus.pdf?src-supplier=Digi-Key; ComponentLink1Description: http://www.winbond.com/resource-files/w25q128jv%20revf%2003272018%20plus.pdf?src-supplier=Digi-Key
U2 = CMP-12756-000043-1: IC REG LINEAR 3.3V 1A SOT223; Manufacturer: Diodes; Output Current: 800mA; Number of Regulators: 1; Dropout Voltage: 1.2V; Description: Linear Voltage Regulator IC Positive Fixed 1 Output 3.3V 800mA SOT-223; RoHS Compliant: Yes; Min Current Limit: 1A; Mount: Surface Mount; Packaging: Tape and Reel; Output Voltage: 3.3V; Min Operating Temperature: -40°C; Max Operating Temperature: 125°C; Number of Pins: 3; Case/Package: TO-261-4; Supplier 1: Digi-Key; Supplier Part Number 1: AZ1117IH-3.3TRG1DICT-ND; Manufacturer Part Number: AZ1117IH-3.3TRG1; RoHS: Yes; Category: Voltage Regulators - Linear; Stock 1: 174531; Pricing 1: 1=0.40000, 10=0.32100, 25=0.29360, 100=0.21840, 250=0.19796, 500=0.16384, 1000=0.12288 (USD); Mounting Technology: Surface Mount; Pins: 3; ComponentLink1URL: https://www.diodes.com/assets/Datasheets/AZ1117I.pdf?src-supplier=Digi-Key; ComponentLink1Description: https://www.diodes.com/assets/Datasheets/AZ1117I.pdf?src-supplier=Digi-Key
U3 = RP2040: ARM® Cortex®-M0+ - Microcontroller IC 32-Bit Dual-Core 133MHz External Program Memory 56-QFN (7x7); Manufacturer: Raspberry Pi; Manufacturer Part Number: SC0914(13); Supplier 1: Digi-Key; RoHS: No; Category: Uncategorized; Stock 1: 117672; Pricing 1: 1=1.00000 (USD); Supplier Part Number 1: 2648-SC0914(13)CT-ND
Y1 = ABLS-12.000MHz-20-B-3-H-T: Crystal 12MHz ±25ppm (Tol) ±35ppm (Stability) 20pF FUND 50Ohm 2-Pin HC-49/US SMD T/R; Manufacturer: Abracon; MF: Abracon LLC; SnapEDA_Link: https://www.snapeda.com/parts/ABLS-12.000MHZ-20-B-3-H-T/Abracon+LLC/view-part/?ref=snap; Check_prices: https://www.snapeda.com/parts/ABLS-12.000MHZ-20-B-3-H-T/Abracon+LLC/view-part/?ref=eda; Digi-Key_Part_Number: 535-15006-2-ND; Package: None; Purchase-URL: https://pricing.snapeda.com/search/part/ABLS-12.000MHZ-20-B-3-H-T/?ref=eda; Value: *; MP: ABLS-12.000MHZ-20-B-3-H-T; Supplier 1: Digi-Key; Manufacturer Part Number: ABLS-12.000MHZ-20-B-3-H-T; RoHS: Yes; Category: Crystals; Stock 1: 7126; Pricing 1: 1=0.16000, 10=0.13500, 50=0.12180, 100=0.10830, 500=0.10288 (USD); ComponentLink1URL: https://abracon.com/Resonators/abls.pdf?src-supplier=Digi-Key; ComponentLink1Description: https://abracon.com/Resonators/abls.pdf?src-supplier=Digi-Key; Supplier Part Number 1: 535-15006-1-ND